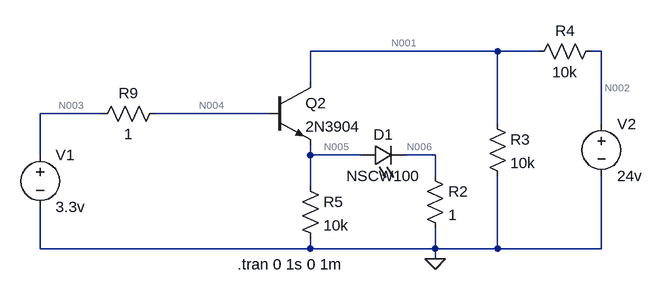
[diagram p0: schematic Prob 5_After.asc]
Prob 5_After.asc, the LTspice schematic file:
Version 4
SHEET 1 1096 680
WIRE 256 128 -32 128
WIRE 320 128 256 128
WIRE 416 128 400 128
WIRE -32 176 -32 128
WIRE -352 224 -448 224
WIRE -96 224 -272 224
WIRE 256 240 256 128
WIRE 416 240 416 128
WIRE -448 288 -448 224
WIRE -32 288 -32 272
WIRE 48 288 -32 288
WIRE 160 288 112 288
WIRE 160 320 160 288
WIRE -32 336 -32 288
WIRE -448 432 -448 368
WIRE -32 432 -32 416
WIRE -32 432 -448 432
WIRE 160 432 160 400
WIRE 160 432 -32 432
WIRE 256 432 256 320
WIRE 256 432 160 432
WIRE 416 432 416 320
WIRE 416 432 256 432
WIRE 160 448 160 432
FLAG 160 448 0
SYMBOL voltage -448 272 R0
WINDOW 123 0 0 Left 0
WINDOW 39 0 0 Left 0
SYMATTR InstName V1
SYMATTR Value 3.3v
SYMBOL voltage 416 224 R0
WINDOW 123 0 0 Left 0
WINDOW 39 0 0 Left 0
SYMATTR InstName V2
SYMATTR Value 24v
SYMBOL npn -96 176 R0
SYMATTR InstName Q2
SYMATTR Value 2N3904
SYMBOL res -368 240 R270
WINDOW 0 32 56 VTop 2
WINDOW 3 0 56 VBottom 2
SYMATTR InstName R9
SYMATTR Value 1
SYMBOL res 240 224 R0
SYMATTR InstName R3
SYMATTR Value 10k
SYMBOL res 416 112 R90
WINDOW 0 0 56 VBottom 2
WINDOW 3 32 56 VTop 2
SYMATTR InstName R4
SYMATTR Value 10k
SYMBOL res -48 320 R0
SYMATTR InstName R5
SYMATTR Value 10k
SYMBOL LED 48 304 R270
WINDOW 0 32 32 VTop 2
WINDOW 3 0 32 VBottom 2
SYMATTR InstName D1
SYMATTR Value NSCW100
SYMATTR Description Diode
SYMATTR Type diode
SYMBOL res 144 304 R0
SYMATTR InstName R2
SYMATTR Value 1
TEXT -144 456 Left 2 !.tran 0 1s 0 1m

The netlist it stands for:
* Prob 5_After.asc
V1 N003 0 3.3v
V2 N002 0 24v
Q2 N001 N004 N005 0 2N3904
R9 N003 N004 1
R3 N001 0 10k
R4 N002 N001 10k
R5 N005 0 10k
D1 N005 N006 NSCW100
R2 N006 0 1
.model D D
.lib standard.dio
.model NPN NPN
.model PNP PNP
.lib standard.bjt
.tran 0 1s 0 1m
.backanno
.end

* Results of the author's LTspice run, read from the files saved beside the schematic
* Operating Point, zero values left out:
*   V(n003) = 3.3 V
*   V(n002) = 24 V
*   V(n001) = 7.28 V
*   V(n004) = 3.3 V
*   V(n005) = 2.647 V
*   V(n006) = 682.3 µV
*   Ic(Q2) = 944 µA
*   Ib(Q2) = 3.033 µA
*   Ie(Q2) = -947 µA
*   I(D1) = 682.3 µA
*   I(R2) = 682.3 µA
*   I(R5) = 264.7 µA
*   I(R4) = 1.672 mA
*   I(R3) = 728 µA
*   I(R9) = 3.033 µA
*   I(V2) = -1.672 mA
*   I(V1) = -3.033 µA